# Altium schematic sheet Sheet1.SchDoc
size A4; SheetNumber: 1; SheetTotal: 1
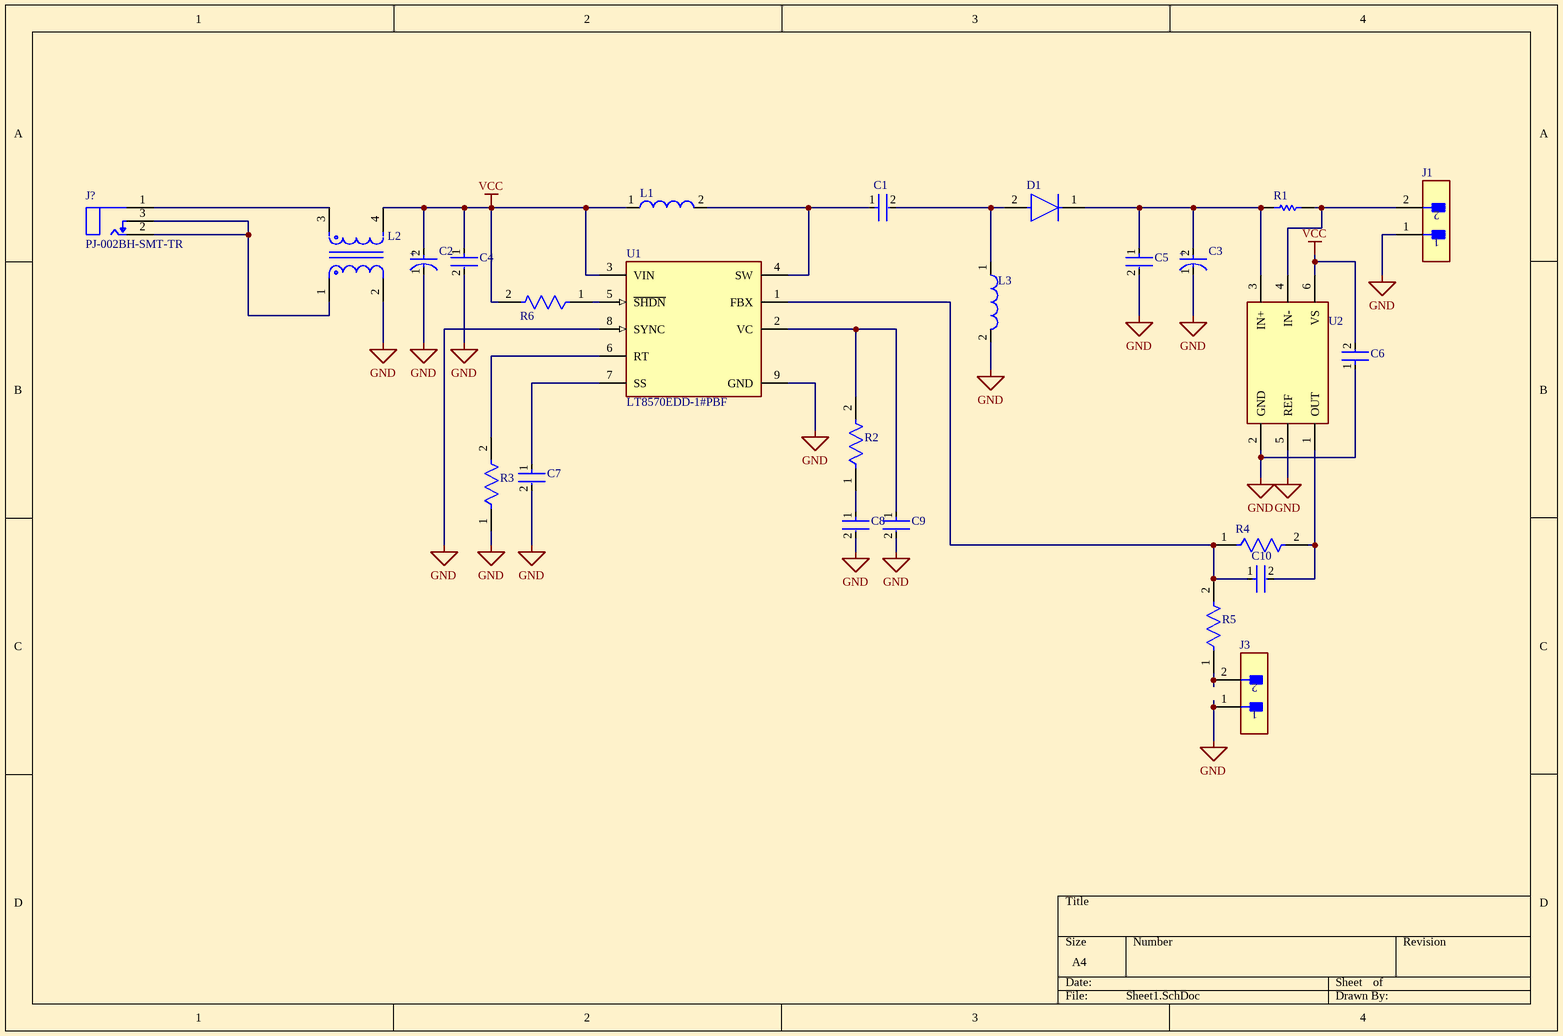
[diagram p0: Sheet1.SchDoc]

## Parts
C1  GRM32ER71J106KA12L  [FP-GRM32E-0_2-0_3-MFG]  (value not drawn)
C2  EEUFR1H221B  [FP-RAD-TH-D_10_0_5-L_16_1-MFG]  (value not drawn)
C3  EEUFR1H221B  [FP-RAD-TH-D_10_0_5-L_16_1-MFG]  (value not drawn)
C4  GRM32ER71J106KA12L  [FP-GRM32E-0_2-0_3-MFG]  (value not drawn)
C5  GRM32ER71J106KA12L  [FP-GRM32E-0_2-0_3-MFG]  (value not drawn)
C6  CL21A226MQQNNNG  [FP-CL21-IPC_B]  (value not drawn)
C7  CL21A226MQQNNNG  [FP-CL21-IPC_B]  (value not drawn)
C8  CL21A226MQQNNNG  [FP-CL21-IPC_B]  (value not drawn)
C9  CL21A226MQQNNNG  [FP-CL21-IPC_B]  (value not drawn)
C10  CL21A226MQQNNNG  [FP-CL21-IPC_B]  (value not drawn)
D1  ES3D-E3/57T  [FP-95402-MFG]  (value not drawn)
J1  TSW-102-07-L-S  [FP-TSW-102-07-L-S-MFG]  (value not drawn)
J3  TSW-102-07-L-S  [FP-TSW-102-07-L-S-MFG]  (value not drawn)
J?  PJ-002BH-SMT-TR  [FP-PJ-002BH-SMT-TR-MFG]
L1  744770233  [WE-PD-XL]  (value not drawn)
L2  P0351NLT  [FP-P0351NLT-MFG]  (value not drawn)
L3  744770233  [WE-PD-XL]  (value not drawn)
R1  CRCW080510R0FKEA  [RESC2013X50X30NL20T20]  (value not drawn)
R2  CRCW080510K0FKEA  [FP-CRCW0805-e3-IPC_A]  (value not drawn)
R3  CRCW080510K0FKEA  [FP-CRCW0805-e3-IPC_A]  (value not drawn)
R4  CRCW080510K0FKEA  [FP-CRCW0805-e3-IPC_A]  (value not drawn)
R5  CRCW080510K0FKEA  [FP-CRCW0805-e3-IPC_A]  (value not drawn)
R6  CRCW080510K0FKEA  [FP-CRCW0805-e3-IPC_A]  (value not drawn)
U1  LT8570EDD-1#PBF  [FP-DD-8-05-08-1698-IPC_A]
U2  INA181A2IDBVT  [FP-DBV0006A-IPC_C]  (value not drawn)

## Nets
GND: C2.1(C) C3.1(C) C4.2 C5.2 C6.1 C7.2 C8.2 C9.2 J1.1 J3.1 L2.2 L3.2 R3.1 U1.8(SYNC) U1.9(GND) U2.2(GND) U2.5(REF)
VCC: C2.2(A) C4.1 C6.2 L1.1 L2.4 R6.2 U1.3(VIN) U2.6(VS)
NetC1_1: C1.1 L1.2 U1.4(SW)
NetC1_2: C1.2 D1.2(A) L3.1
NetC3_2: C3.2(A) C5.1 D1.1(C) R1.1 U2.3(IN+)
NetC7_1: C7.1 U1.7(SS)
NetC8_1: C8.1 R2.1
NetC9_1: C9.1 R2.2 U1.2(VC)
NetC10_1: C10.1 R4.1 R5.2 U1.1(FBX)
NetC10_2: C10.2 R4.2 U2.1(OUT)
NetJ1_2: J1.2 R1.2 U2.4(IN-)
NetJ3_2: J3.2 R5.1
NetJ?_1: J?.1 L2.3
NetJ?_2: J?.2 J?.3 L2.1
NetR3_2: R3.2 U1.6(RT)
NetR6_1: R6.1 U1.5(~{SHDN})

## Notes on the sheet
- (in symbol CMP-05427-000403-1) +

## Library data of the parts
C1 C4 C5 = CMP-2000-07458-2: CAP CER 10UF 63V X7R 1210; Material: Ceramic; Tolerance: 10%; Package Quantity: 1000; Weight: 0.00388oz; Voltage Rating (DC): 63V; Packaging: Tape and Reel; Length: 3.2mm; Width: 2.5mm; REACH SVHC: No SVHC; Max Operating Temperature: 125°C; Dielectric Material: Ceramic; Thickness: 0.106inch; Mount: Surface Mount; Case Code (Metric): 3225; Depth: 2.5mm; Voltage Rating: 63V; RoHS Compliant: Yes; Capacitance: 10uF; Lead Free: Lead Free; Dielectric: X7R; Case Code (Imperial): 1210; Min Operating Temperature: -55°C; Height: 2.5mm; Case/Package: 1210; Voltage: 63V; Termination: SMD/SMT
C2 C3 = CMP-05427-000403-1: Aluminum Electrolytic Capacitors (Radial Lead Type) 220uF ±20% 50V; ESR (Equivalent Series Resistance): 30mR; Ripple Current: 1.65A; Lead Diameter: 0.6mm; Life (Hours): 8000Hour; Height: 16mm; Min Operating Temperature: -40°C; Lead Pitch: 5mm; Diameter: 10mm; Features: General Purpose; Tolerance: 20%; Mount: Through Hole; Number of Pins: 2; Series: FR; Max Operating Temperature: 105°C; Contact Plating: Tin; Impedance: 30mR; Length: 16mm; Package Quantity: 1; RoHS Compliant: Yes; Lead Free: Lead Free; Voltage Rating: 50V; Packaging: Ammo Pack; Radiation Hardening: No; Termination: Radial; Voltage Rating (DC): 50V; Case/Package: Radial; Capacitance: 220uF; REACH SVHC: No SVHC; Height - Seated (Max): 0.689inch
C6-C10 = CMP-13271-002967-1: CL21 Series 0805 22uF 6.3V ±20% Tolerance X5R Multilayer Ceramic Chip Capacitor; Tolerance: 20%; Case Code (Imperial): 0805; Package Quantity: 3000; Min Operating Temperature: -55°C; Capacitance: 22uF; Case Code (Metric): 2012; Length: 2mm; Material: Ceramic; Max Operating Temperature: 85°C; Radiation Hardening: No; Packaging: Tape and Reel; Depth: 1.25mm; Mount: Surface Mount; Dielectric: X5R; Case/Package: 0805; Height: 1.25mm; Thickness: 0.055inch; Voltage: 6.3V; Width: 0.049inch; Voltage Rating: 6.3V
D1 = CMP-02540-000021-1: DIODE GEN PURP 200V 3A DO214AB; Manufacturer: Vishay; Capacitance: 45pF; Value: 45pF; Max Surge Forward Current: 100A; Peak Reverse Current: 10uA; Standoff Height: 0mm; Max Junction Temp: +150°C; Height: 2.62mm; Category: Diode; Device Class L3: Rectifier Diodes; Manufacturer Part Number: ES3D-E3/57T; Temperature Range Low: -55°C; ComponentLink2URL: http://www.vishay.com/docs/88589/es3.pdf; Mouser Description: Rectifiers 3.0 Amp 200V 20ns; Package: 95402; Temperature Range High: +150°C; Octopart: https://octopart.com/es3d-e3%2F57t-vishay-39550290; Automotive: No; RoHS: TRUE; Forward Current: 3A; Temperature: -55°C to +150°C; Max Repetitive Reverse Voltage: 200V; Device Class L1: Discrete Semiconductors; Reverse Voltage: 200V; Lead Free: Yes; Digikey Description: DIODE GEN PURP 200V 3A DO214AB; Footprint Url: https://www.vishay.com/docs/95402/smc.pdf; ComponentLink2Description: Datasheet; Device Class L2: Diodes
J1 J3 = CMP-02766-001428-1: CONN HEADER VERT 2POS 2.54MM; Voltage Rating: 550V; Current Rating: 7.6A; Gender: Male; Number of Contacts: 2; Connector Type: Male Pin; Radiation Hardening: No; Orientation: Straight; Contact Plating: Gold; Max Operating Temperature: 125°C; Mount: Through Hole; Package Quantity: 1; Number of Rows: 1; Housing Material: Polyester; RoHS Compliant: Yes; Length: 5.08mm; Max Voltage Rating (AC): 550V; Pitch: 2.54mm; Packaging: Bulk; Depth: 2.54mm; Termination: Solder; Min Operating Temperature: -55°C; Housing Color: Black; Lead Free: Lead Free; Color: Black; Number of Positions: 2; Width: 2.54mm; Max Current Rating: 7.6A; REACH SVHC: No SVHC; Contact Material: Bronze; Contact Mating Length: 0.23inch; Series: TSW; Contact Type: Male Pin
J? = CMP-2000-06897-2: CONN PWR JACK 2.5X5.5MM SOLDER; Manufacturer: CUI Inc; Current Rating: 5A; Standoff Height: 0.1mm; Voltage Rating: 24V; Conn Gender: Male; Conn Orientation: Right Angle; Number Of Contacts: 3; Temperature Range Low: -25°C; Category: Conn; Package: 0; Device Class L2: Power Connectors; Contact Material: Nickel,Silver; Automotive: No; Mouser Description: 2.5 mm Center Pin, 5.0 A, Right Angle, Surface Mount (SMT), Dc Power Jack Connector; Device Class L3: unset; ComponentLink2URL: https://www.cuidevices.com/product/resource/digikeypdf/pj-002bh-smt-tr.pdf; Octopart: https://octopart.com/pj-002bh-smt-tr-cui-25947151; Manufacturer Part Number: PJ-002BH-SMT-TR; Lead Free: Yes; ComponentLink2Description: Datasheet; Digikey Description: CONN PWR JACK 2.5X5.5MM SOLDER; Height: 11.43mm; Temperature: -25°C to +85°C; RoHS: TRUE; Device Class L1: Connectors; Temperature Range High: +85°C
L1 L3 = CMP-0227-00189-1: SMD-Shielded Power Inductor WE-PD, L = 330 µH; Inductance: 330 ÂµH; PackageDescription: SMD Inductor, 2-Leads, Body 12.0 x 12.0 mm; ComponentLink1Description: Manufacturer Link; PackageReference: WE-PD-XL; PackageVersion: 2004; ComponentLink2URL: http://www.we-online.de/katalog/media/pdf/744770233.pdf; ComponentLink2Description: Datasheet; DatasheetVersion: ver 5, Oct-2004; ComponentLink1URL: http://www.we-online.com
L2 = CMP-16296-000003-1: COMMON MODE CHOKE 2.8A 2LN SMD; Shielding: Unshielded; Tolerance: 35%; Inductance: 1.47mH; DC Resistance (DCR): 80mR; Number of Lines: 2; Width: 0.67inch; Series: -; Package Quantity: 1; Termination: SMD/SMT; Number of Pins: 50; Min Operating Temperature: -40°C; Radiation Hardening: No; Case/Package: SMD/SMT; Length: 19.56mm; REACH SVHC: No SVHC; Max Operating Temperature: 120°C; Height: 9.91mm; DC Current: 2.8A; Mount: Surface Mount; Packaging: Tape and Reel; Depth: 17.02mm; Current: 2.8A; Military Standard: Not; Max DC Current: 2.8A
R1 = CMP-2001-04915-1: Manufacturer: Vishay Dale; Part Number: CRCW080510R0FKEA
R2-R6 = CMP-2001-04908-2: RES Thick Film, 10kΩ, 1%, 0.125W, 100ppm/°C, 0805; Resistance: 10kR; Voltage Rating (DC): 150V; Power Rating: 125mW; Weight: 0.000194oz; Package Quantity: 5000; Military Standard: Not; Max Operating Temperature: 155°C; Temperature Coefficient: 100ppm/°C; Contact Plating: Tin; Width: 1.25mm; Height: 0.45mm; Radiation Hardening: No; Tolerance: 1%; Min Operating Temperature: -55°C; Voltage Rating: 150V; Length: 2mm; Depth: 1.25mm; Termination: SMD/SMT; Packaging: Tape and Reel; Case/Package: 0805; Case Code (Metric): 2012; Lead Free: Lead Free; Case Code (Imperial): 0805; Composition: Thick Film
U1 = CMP-09139-000130-1: IC REG MULT CONFG ADJ 375MA 8DFN; Max Input Voltage: 40V; Min Input Voltage: 2.55V; Number of Outputs: 1; Switching Frequency: 1.5MHz; Topology: Boost; Synchronous Rectifier: No; Min Output Voltage: 1.204V; Max Output Voltage: 65V; Output Type: Adjustable; Case/Package: DFN; Min Operating Temperature: -40°C; Packaging: Rail/Tube; Number of Pins: 8; Output Current: 375mA; REACH SVHC: No SVHC; Max Operating Temperature: 125°C; Mount: Surface Mount; Output Voltage: 65V; RoHS Compliant: Yes
U2 = CMP-04895-000249-1: IC CURR SENSE 1 CIRCUIT SOT23-6; Operating Supply Current: 260uA; Number of Circuits: 1; Slew Rate: 2V/µs; -3db Bandwidth: 350kHz; Max Operating Temperature: 125°C; Min Operating Temperature: -40°C; Case/Package: SOT-23-6; Packaging: Tape and Reel; RoHS Compliant: Yes; Mount: Surface Mount